# EAGLE schematic PatientBedAdapter (EAGLE 6.4)
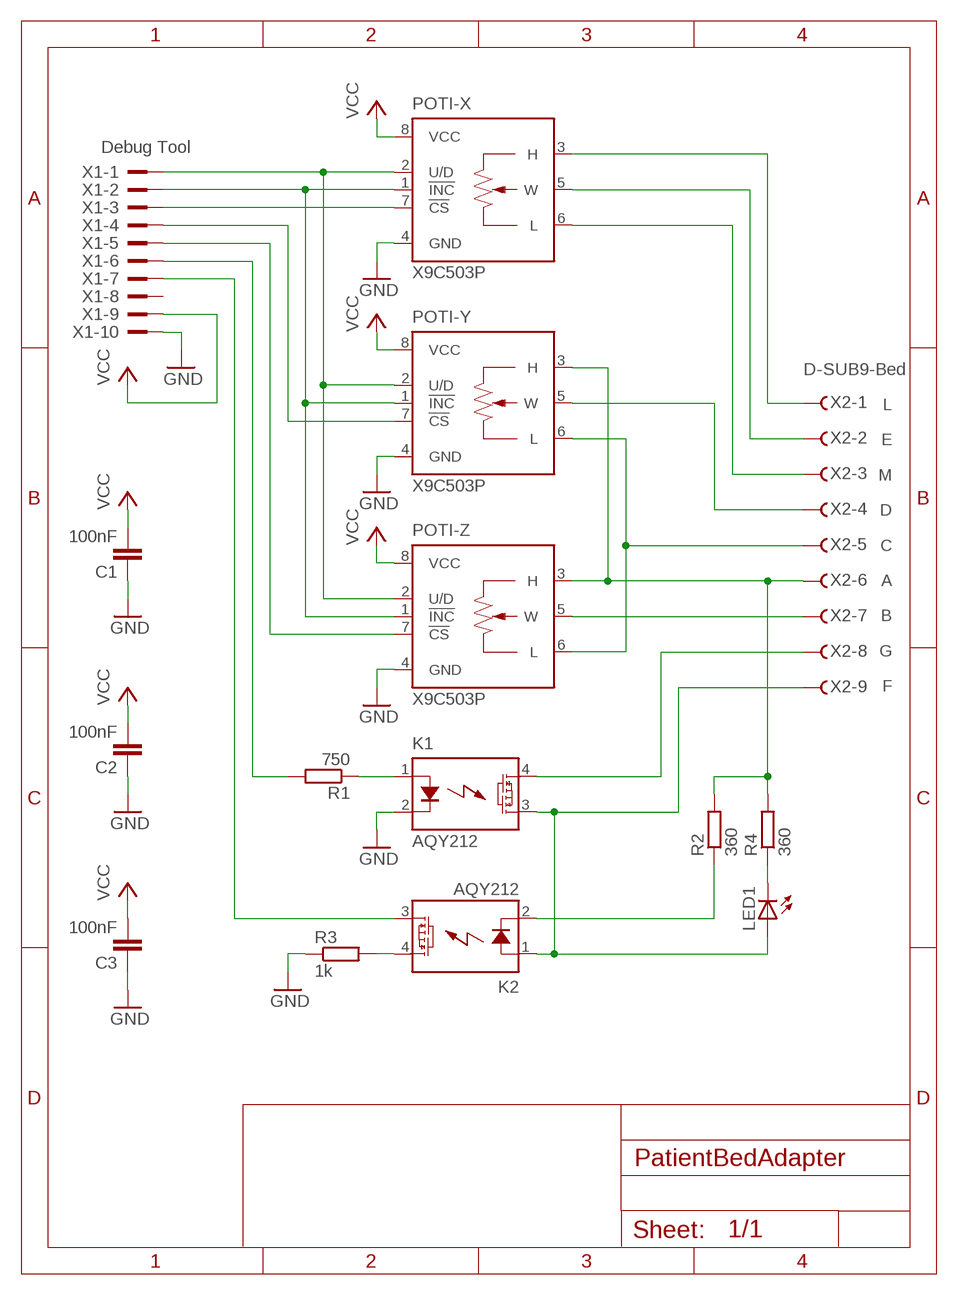
[diagram p0: schematic, sheet 1]

## Parts
C1  100nF  C-EU050-024X044  [C050-024X044]
C2  100nF  C-EU050-024X044  [C050-024X044]
C3  100nF  C-EU050-024X044  [C050-024X044]
K1  AQY212  AQY21SOP  [SOP04]
K2  AQY212  AQY21SOP  [SOP04]
LED1  LED3MM  [LED3MM]
POTI-X  X9C503P  X9C102P  [DIL08]
POTI-Y  X9C503P  X9C102P  [DIL08]
POTI-Z  X9C503P  X9C102P  [DIL08]
R1  750  R-EU_R1206  [R1206]
R2  360  R-EU_R1206  [R1206]
R3  1k  R-EU_R1206  [R1206]
R4  360  R-EU_R1206  [R1206]
X1  Debug Tool  2510-  [PAK100/2500-10]
X2  D-SUB9-Bed  D-SUB9-H5M09RA  [H5M09RA]

## Nets
GND: C1.1 C2.1 C3.1 K1.2(K) POTI-X.4(GND) POTI-Y.4(GND) POTI-Z.4(GND) R3.1 X1.10
N$1: K1.1(A) R1.1
N$2: POTI-X.2(U/D) POTI-Y.2(U/D) POTI-Z.2(U/D) X1.1
N$3: POTI-X.1(!INC) POTI-Y.1(!INC) POTI-Z.1(!INC) X1.2
N$4: POTI-X.7(!CS) X1.3
N$5: POTI-Y.7(!CS) X1.4
N$6: K2.3(DS2) X1.7
N$7: K2.4(DS1) R3.2
N$8: K1.3(DS2) K2.1(A) LED1.A X2.9
N$9: LED1.K(C) R4.1
N$10: R1.2 X1.6
N$11: POTI-Z.7(!CS) X1.5
N$12: POTI-Y.3(H) POTI-Z.3(H) R2.2 R4.2 X2.6
N$13: POTI-Y.6(L) POTI-Z.6(L) X2.5
N$15: K2.2(K) R2.1
N$16: POTI-X.3(H) X2.1
N$17: POTI-X.5(W) X2.2
N$18: POTI-X.6(L) X2.3
N$19: POTI-Y.5(W) X2.4
N$20: POTI-Z.5(W) X2.7
N$21: K1.4(DS1) X2.8
VCC: C1.2 C2.2 C3.2 POTI-X.8(VCC) POTI-Y.8(VCC) POTI-Z.8(VCC) X1.9
Unconnected: X1.8

## Notes on the sheet
- L
  
  E
  
  M
  
  D
  
  C
  
  A
  
  B
  
  G
  
  F

## Library data of the parts
C1-C3 = rcl:C-EU: CAPACITOR, European symbol
K1 K2 = relay:AQY*: PhotoMOS Relay NAiS Source: http://www.panasonic-electric-works.com/catalogues/downloads/photomos/ds_x615_en_aqz10_20.pdf; OC_FARNELL: unknown; OC_NEWARK: unknown
LED1 = led:LED: LED OSRAM: - CHIPLED LG R971, LG N971, LY N971, LG Q971, LY Q971, LO R971, LY R971 LH N974, LH R974 LS Q976, LO Q976, LY Q976 LO Q996 - Hyper CHIPLED LW Q18S LB Q993, LB Q99A, LB R99A - SideLED LS A670, LO A670, LY A670, LG A670, LP A670 LB A673, LV A673, LT A673, LW A673 LH A674 LY A675 LS A676, LA A676, LO A676, LY A676, LW A676 LS A679, LY A679, LG A679 - Hyper Micro SIDELED® LS Y876, LA Y876, LO Y876, LY Y876 LT Y87S - SmartLED LW L88C, LW L88S LB L89C, LB L89S, LG L890 LS L89K, LO L89K, LY L89K LS L896, LA L896, LO L896, LY L896 - TOPLED LS T670, LO T670, LY T670, LG T670, LP T670 LSG T670, LSP T670, LSY T670, LOP T670, LYG T670 LG T671, LOG T671, LSG T671 LB T673, LV T673, LT T673, LW T673 LH T674 LS T676, LA T676, LO T676, LY T676, LB T676, LH T676, LSB T676, LW T676 LB T67C, LV T67C, LT T67C, LS T67K, LO T67K, LY T67K, LW E67C LS E67B, LA E67B, LO E67B, LY E67B, LB E67C, LV E67C, LT E67C LW T67C LS T679, LY T679, LG T679 LS T770, LO T770, LY T770, LG T770, LP T770 LB T773, LV T773, LT T773, LW T773 LH T774 LS E675, LA E675, LY E675, LS T675 LS T776, LA T776, LO T776, LY T776, LB T776 LHGB T686 LT T68C, LB T68C - Hyper Mini TOPLED® LB M676 - Mini TOPLED Santana® LG M470 LS M47K, LO M47K, LY M47K Source: http://www.osram.convergy.de LUXEON: - LUMILED® LXK2-PW12-R00, LXK2-PW12-S00, LXK2-PW14-U00, LXK2-PW14-V00 LXK2-PM12-R00, LXK2-PM12-S00, LXK2-PM14-U00 LXK2-PE12-Q00, LXK2-PE12-R00, LXK2-PE12-S00, LXK2-PE14-T00, LXK2-PE14-U00 LXK2-PB12-K00, LXK2-PB12-L00, LXK2-PB12-M00, LXK2-PB14-N00, LXK2-PB14-P00, LXK2-PB14-Q00 LXK2-PR12-L00, LXK2-PR12-M00, LXK2-PR14-Q00, LXK2-PR14-R00 LXK2-PD12-Q00, LXK2-PD12-R00, LXK2-PD12-S00 LXK2-PH12-R00, LXK2-PH12-S00 LXK2-PL12-P00, LXK2-PL12-Q00, LXK2-PL12-R00 Source: www.luxeon.com KINGBRIGHT: KA-3528ASYC Source: www.kingbright.com
POTI-X POTI-Y POTI-Z = pot-xicor:X9C102*: Digital POTENTIOMETER; MF: INTERSIL; MPN: X9C102P; OC_FARNELL: 1216104; OC_NEWARK: 51J6928
R1-R4 = rcl:R-EU_: RESISTOR, European symbol
X1 = con-3m:2510-: 3M (TM) Pak 100 4-Wall Header Source: 3M; MF: 3M; MPN: 2510-6002UB; OC_FARNELL: 9838244; OC_NEWARK: 46F4725
X2 = con-thomas-betts:D-SUB9-: D-Subminiatur Connector Source: Electronioc Interconnects European Edition 1998; OC_FARNELL: unknown; OC_NEWARK: unknown